# EAGLE design Backpack_Panel (EAGLE 7.2.0)
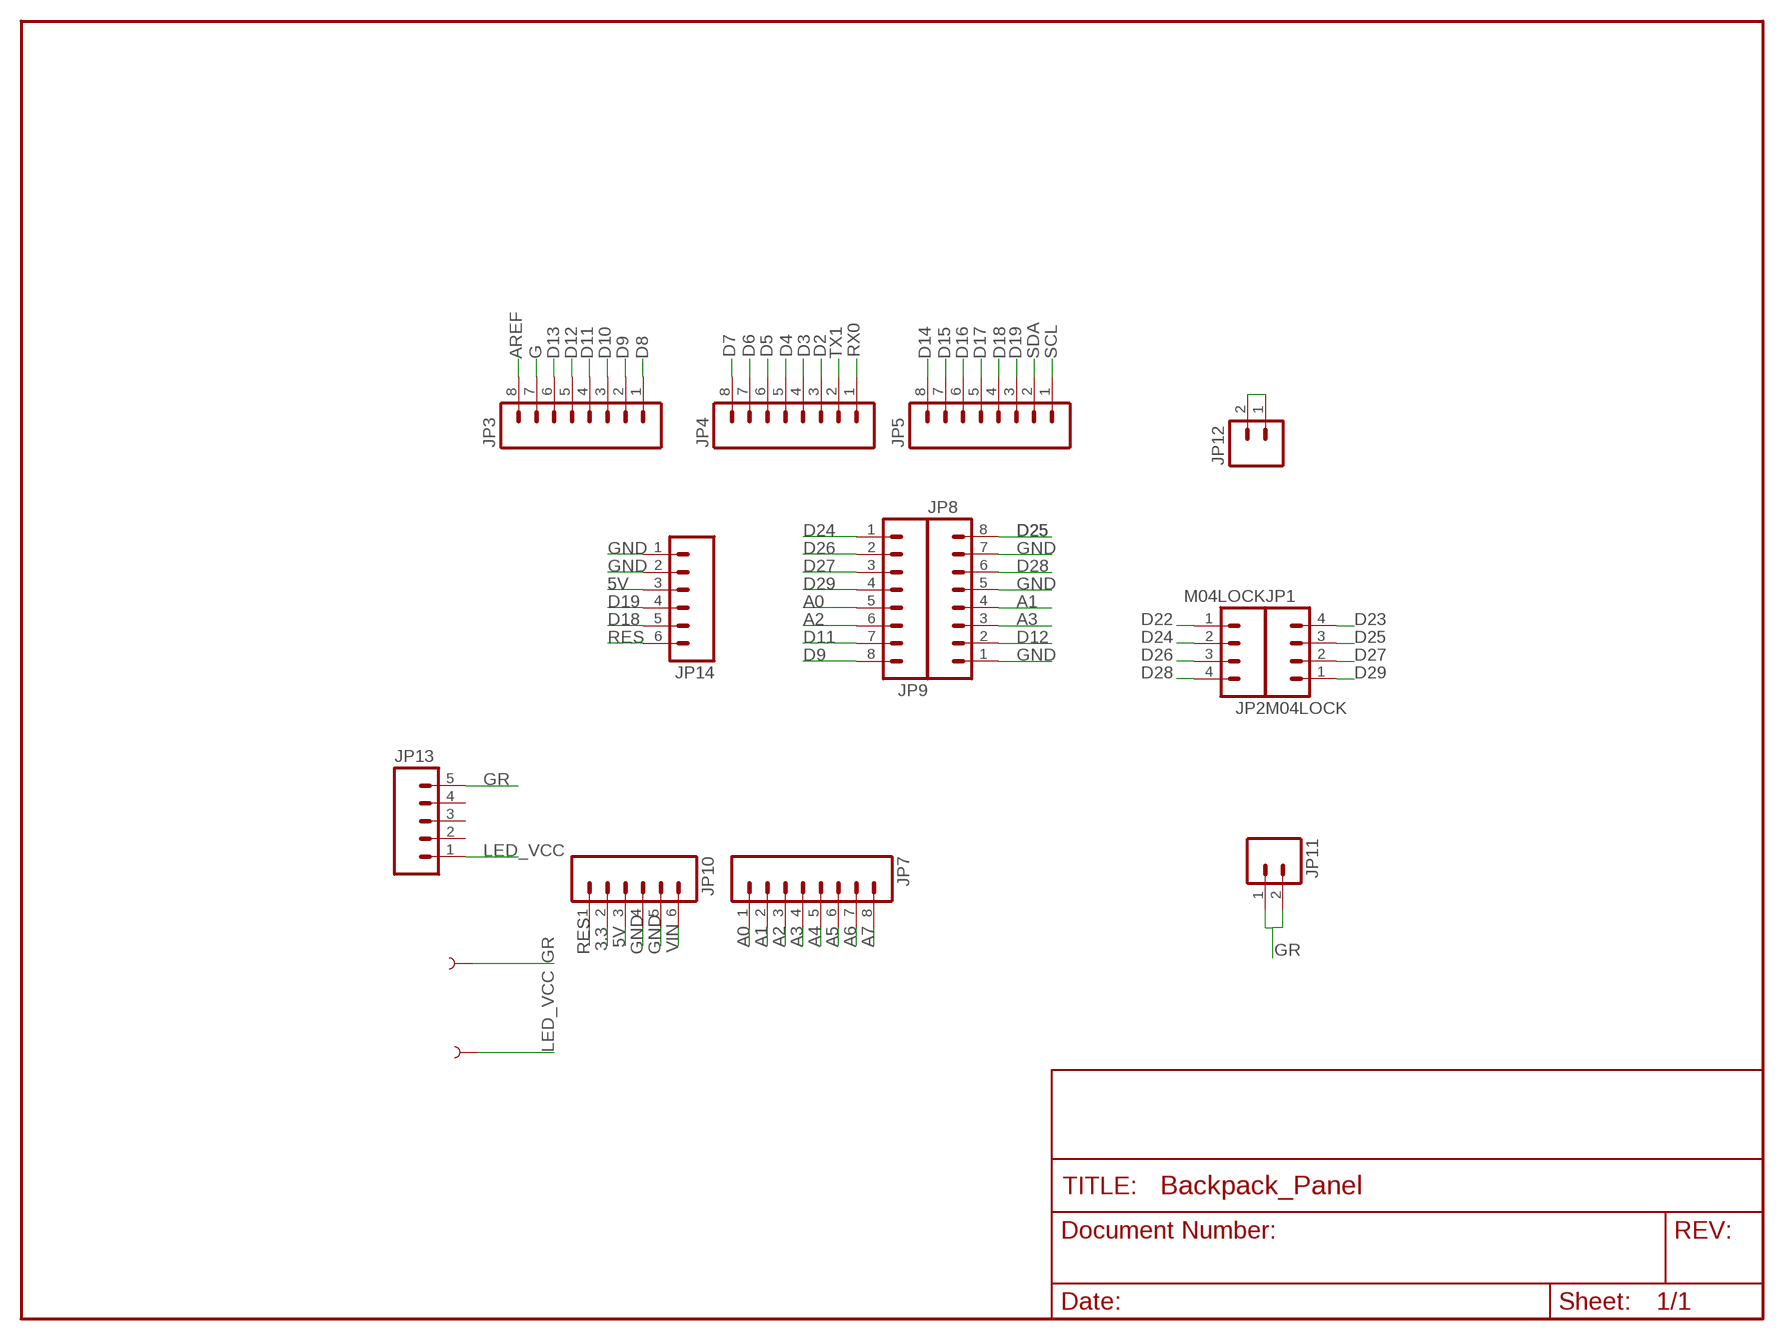
[diagram p0: schematic, sheet 1]

## Parts
JP1  M04LOCK  [1X04_LOCK]
JP2  M04LOCK  [1X04_LOCK]
JP3  M08LOCK  [1X08_LOCK]
JP4  M08LOCK  [1X08_LOCK]
JP5  M08LOCK  [1X08_LOCK]
JP7  M08LOCK  [1X08_LOCK]
JP8  M08LOCK  [1X08_LOCK]
JP9  M08LOCK  [1X08_LOCK]
JP10  M06LOCK  [1X06_LOCK]
JP11  M02LOCK  [1X02_LOCK]
JP12  M02LOCK  [1X02_LOCK]
JP13  M05LOCK  [1X05_LOCK]
JP14  M06LOCK  [1X06_LOCK]
U$1  SEWTAP2  [PETAL-LONG-2]
U$2  SEWTAP2  [PETAL-LONG-2]

## Nets
3.3: JP10.2
5V: JP10.3 JP14.3
A0: JP7.1 JP9.5
A1: JP7.2 JP8.4
A2: JP7.3 JP9.6
A3: JP7.4 JP8.3
A4: JP7.5
A5: JP7.6
A6: JP7.7
A7: JP7.8
AREF: JP3.8
D2: JP4.3
D3: JP4.4
D4: JP4.5
D5: JP4.6
D6: JP4.7
D7: JP4.8
D8: JP3.1
D9: JP3.2 JP9.8
D10: JP3.3
D11: JP3.4 JP9.7
D12: JP3.5 JP8.2
D13: JP3.6
D14: JP5.8
D15: JP5.7
D16: JP5.6
D17: JP5.5
D18: JP5.4 JP14.5
D19: JP5.3 JP14.4
D22: JP2.1
D23: JP1.4
D24: JP2.2 JP9.1
D25: JP1.3 JP8.8
D26: JP2.3 JP9.2
D27: JP1.2 JP9.3
D28: JP2.4 JP8.6
D29: JP1.1 JP9.4
G: JP3.7
GND: JP8.1 JP8.5 JP8.7 JP10.4 JP10.5 JP14.1 JP14.2
GR: JP11.1 JP11.2 JP13.5 U$1.1
LED_VCC: JP13.1 U$2.1
N$1: JP12.1 JP12.2
RES: JP10.1 JP14.6
RX0: JP4.1
SCL: JP5.1
SDA: JP5.2
TX1: JP4.2
VIN: JP10.6
Unconnected: JP13.2 JP13.3 JP13.4

## Library data of the parts
JP1 JP2 = SparkFun-Connectors:M04: Header 4 Standard 4-pin 0.1" header. Use with straight break away headers (SKU : PRT-00116), right angle break away headers (PRT-00553), swiss pins (PRT-00743), machine pins (PRT-00117), and female headers (PRT-00115). Molex polarized connector foot print use with SKU : PRT-08231 with associated crimp pins and housings. 1MM SMD Version SKU: PRT-10208
JP3-JP5 JP7 = SparkFun:M08: Header 8 Standard 8-pin 0.1" header. Use with straight break away headers (SKU : PRT-00116), right angle break away headers (PRT-00553), swiss pins (PRT-00743), machine pins (PRT-00117), and female headers (PRT-00115).
JP8 JP9 = SparkFun-Connectors:M08: Header 8 Standard 8-pin 0.1" header. Use with straight break away headers (SKU : PRT-00116), right angle break away headers (PRT-00553), swiss pins (PRT-00743), machine pins (PRT-00117), and female headers (PRT-00115).
JP10 = SparkFun:M06: Header 6 Standard 6-pin 0.1" header. Use with straight break away headers (SKU : PRT-00116), right angle break away headers (PRT-00553), swiss pins (PRT-00743), machine pins (PRT-00117), and female headers (PRT-00115). Molex polarized connector foot print use with SKU : PRT-08094 with associated ...
JP11 JP12 = SparkFun:M02: Header 2 Standard 2-pin 0.1" header. Use with straight break away headers (SKU : PRT-00116), right angle break away headers (PRT-00553), swiss pins (PRT-00743), machine pins (PRT-00117), and female headers (PRT-00115). Molex polarized connector foot print use with SKU : PRT-08233 with associated crimp pins and housings.
JP13 = SparkFun-Connectors:M05: Header 5 Standard 5-pin 0.1" header. Use with straight break away headers (SKU : PRT-00116), right angle break away headers (PRT-00553), swiss pins (PRT-00743), machine pins (PRT-00117), and female headers (PRT-00115). Molex polarized connector foot print use with SKU : PRT-08230 with associated crimp pins and housings.
JP14 = SparkFun-Connectors:M06: Header 6 Standard 6-pin 0.1" header. Use with straight break away headers (SKU : PRT-00116), right angle break away headers (PRT-00553), swiss pins (PRT-00743), machine pins (PRT-00117), and female headers (PRT-00115). Molex polarized connector foot print use with SKU : PRT-08094 with associated ...
U$1 U$2 = LilyPad-Wearables:SEWTAP

## Board
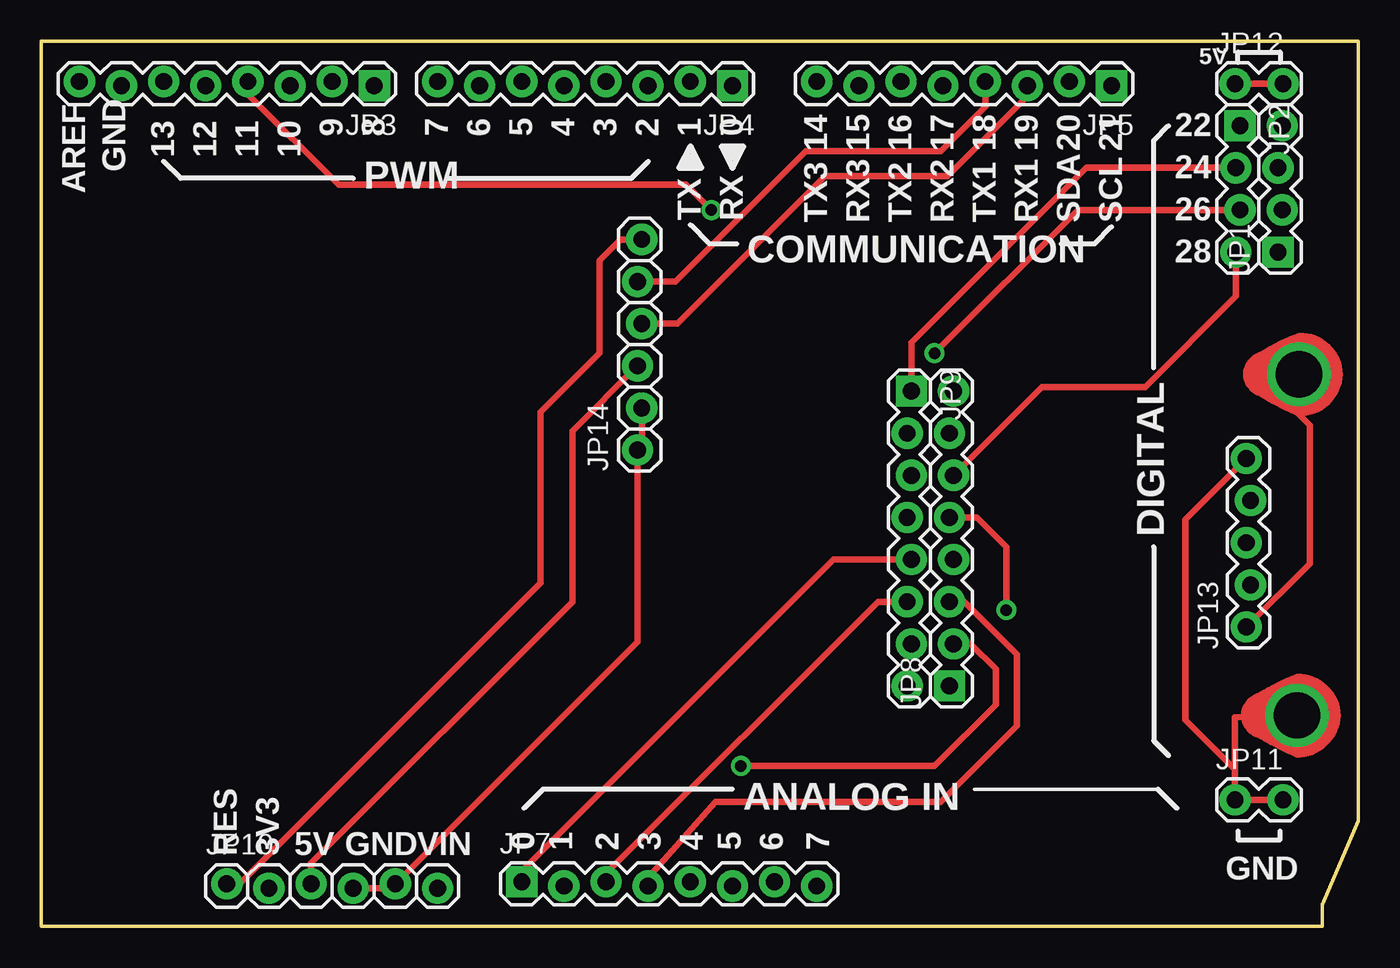
[diagram p1: board, top side]
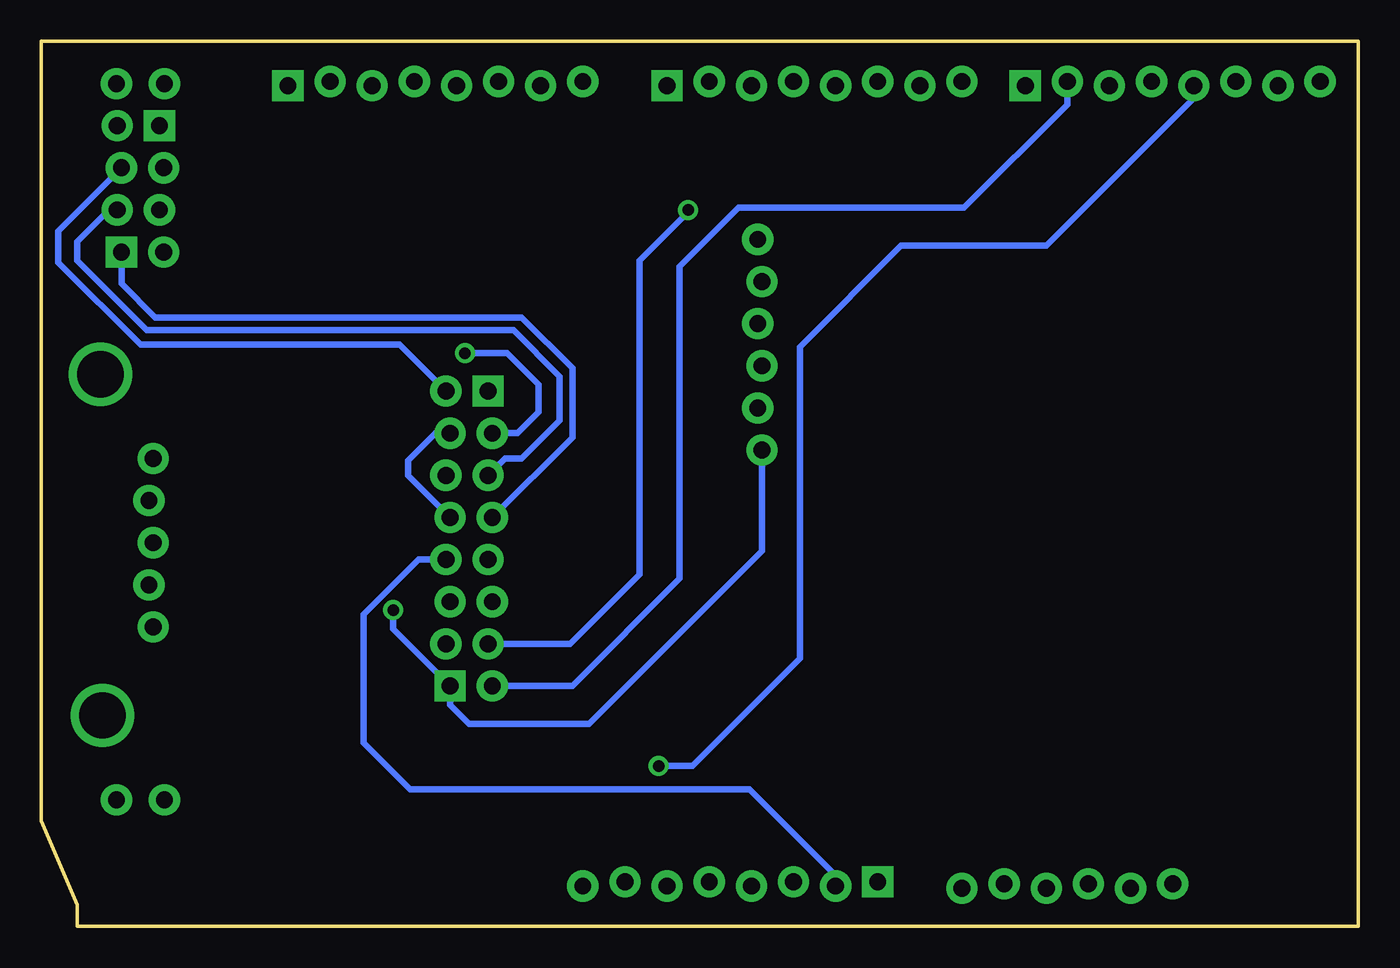
[diagram p2: board, bottom side, seen from below]

Size 79.38 x 53.34 mm. Coordinates in mm from the lower left corner, seen from the top.
Outline: 0,0 77.22,0 77.22,1.27 79.38,6.35 79.38,53.34 0,53.34 0,0
Copper layers (1*16): Top 0.035mm / dielectric 1.5mm / Bottom 0.035mm
Design rules "SparkFun": minimum track width 8mil, minimum drill 20mil, track to track 8mil, track to pad 8mil, pad to pad 8mil, via to via 8mil, smd to smd 8mil, copper to edge 10mil, drill to drill 8mil, minimum pad ring 12mil, minimum via ring 10mil, stop-mask expansion 4mil, vias tented up to drill 25mil, thermal gap 10mil

### Footprints (pad centres in the part's own frame; a part is rotated, then mirrored left to right if it is on the bottom)
1X04_LOCK = drill 1.016 pad 1.88 square: 1 0,0.127 | drill 1.016 pad 1.88: 2 2.54,-0.127; 3 5.08,0.127; 4 7.62,-0.127
1X08_LOCK = drill 1.016 pad 1.88 square: 1 0,0.127 | drill 1.016 pad 1.88: 2 2.54,-0.127; 3 5.08,0.127; 4 7.62,-0.127; 5 10.16,0.127; 6 12.7,-0.127; 7 15.24,0.127; 8 17.78,-0.127
1X06_LOCK = drill 1.016 pad 1.88: 1 0,0; 2 2.54,-0.254; 3 5.08,0; 4 7.62,-0.254; 5 10.16,0; 6 12.7,-0.254
1X02_LOCK = drill 1.016 pad 1.88: 1 -0.178,0; 2 2.718,0
1X05_LOCK = drill 1.016 pad 1.88: 1 0,0.127; 2 2.54,-0.127; 3 5.08,0.127; 4 7.62,-0.127; 5 10.16,0.127
PETAL-LONG-2 = drill 2.794: 1 0,0

### Placement (x,y rotation side)
JP1  74.68,40.64 90 top
JP2  72.14,48.26 270 top
JP3  20.07,50.8 180 top
JP4  41.66,50.8 180 top
JP5  64.52,50.8 180 top
JP7  28.96,2.54 0 top
JP8  54.86,14.48 90 top
JP9  52.32,32.26 270 top
JP10  11.18,2.54 0 top
JP11  72.14,7.62 0 top
JP12  72.14,50.8 0 top
JP13  72.77,18.03 90 top
JP14  35.94,28.7 90 top
U$1  75.69,12.7 90 top
U$2  75.82,33.27 90 top

### Tracks (layer width: path | path; a pad name or v marks a point on that pad's centre or on a via)
5V
  Top 0.406: JP10.3 16.26,3.81 32,19.56 32,29.84 JP14.3
A0
  Top 0.203: JP7.1 28.96,2.54
  Top 0.406: JP7.1 28.96,3.3 47.75,22.1 JP9.5
A1
  Bottom 0.406: JP7.2 31.5,3.05 36.7,8.26 57.15,8.26 59.94,11.05 59.94,18.8 56.64,22.1 JP8.4
A2
  Top 0.203: JP7.3 34.04,2.54
  Top 0.406: JP7.3 34.04,3.17 50.42,19.56 JP9.6
A3
  Top 0.406: JP7.4 36.58,2.92 40.64,7.49 54.23,7.49 58.8,12.07 58.8,16.38 55.5,19.68 54.86,19.68 JP8.3
D9
  Bottom 0.406: JP3.2 17.53,49.53 23.75,43.31 37.34,43.31 40.89,39.75 40.89,20.95 47.37,14.48 JP9.8
D11  (via drill 0.7)
  Top 0.406: JP3.4 12.45,50.16 17.91,44.7 38.86,44.7 v40.39,43.18
  Bottom 0.406: v40.39,43.18 40.39,43.05 43.31,40.13 43.31,21.21 47.5,17.02 JP9.7
D12  (via drill 0.7)
  Top 0.406: JP8.2 56.01,17.02 57.53,15.49 57.53,13.34 53.85,9.65 v42.16,9.65
  Bottom 0.406: JP3.5 9.91,49.91 18.8,41.02 27.56,41.02 33.66,34.93 33.66,16.13 40.13,9.65 v42.16,9.65
D18
  Top 0.406: JP5.4 56.9,49.4 54.23,46.74 46.1,46.74 38.23,38.86 JP14.5
D19
  Top 0.406: JP5.3 59.44,50.04 54.61,45.21 47.24,45.21 38.35,36.32 JP14.4
D24
  Top 0.406: JP2.2 62.99,45.72 52.45,35.18 JP9.1
D25
  Bottom 0.406: JP1.3 78.36,41.91 78.36,40.01 73.41,35.05 57.78,35.05 JP8.8
D26  (via drill 0.7)
  Top 0.406: JP2.3 62.48,43.18 v53.85,34.54
  Bottom 0.406: v53.85,34.54 51.31,34.54 49.4,32.64 49.4,30.99 50.67,29.72 JP9.2
D27
  Bottom 0.406: JP1.2 75.31,43.18 77.22,41.28 77.22,40.13 73.03,35.94 50.93,35.94 48.13,33.15 48.13,30.48 50.42,28.19 51.44,28.19 JP9.3
D28
  Top 0.406: JP2.4 72.01,37.97 66.55,32.51 60.33,32.51 JP8.6
D29
  Bottom 0.406: JP1.1 74.55,38.73 72.52,36.7 50.42,36.7 47.37,33.66 47.37,29.46 JP9.4
GND  (via drill 0.7)
  Top 0.406: JP10.4 21.08,2.29 JP10.5 35.94,17.14 JP14.1 35.94,28.19 36.2,28.45 JP14.2 | JP8.5 56.39,24.64 58.17,22.86 v58.17,19.05
  Bottom 0.406: JP14.1 35.94,22.61 46.35,12.19 53.59,12.19 54.74,13.34 JP8.1 58.17,17.91 v58.17,19.05 | JP8.7 55.63,29.72 57.28,28.07 57.28,27.18 JP8.5
GR
  Top 0.406: JP11.2 JP11.1 71.96,9.45 | 71.96,9.45 68.96,12.45 68.96,24.51 JP13.5 | U$1.1 71.96,12.57 71.96,9.45
LED_VCC
  Top 0.406: U$2.1 73.66,33.02 76.45,30.23 76.45,21.84 JP13.1
N$1
  Top 0.406: JP12.2 JP12.1
RES
  Top 0.406: JP10.1 11.94,2.54 30.1,20.7 30.1,30.99 33.66,34.54 33.66,40.13 34.92,41.4 JP14.6

### Text on the board
tPlace: 5V | 9 | 8 | 7 | 6 | 5 | 4 | 3 | 2 | 1 | 0 | 14 | 15 | 16 | 17 | 18 | 19 | 20 | 21 | 22 | 13 | 12 | 11 | 10 | GND | 24 | AREF | PWM | TX | RX | TX3 | RX3 | TX2 | RX2 | TX1 | RX1 | SDA | SCL | 26 | COMMUNICATION | 28 | DIGITAL | ANALOG IN | RES | 3V3 | 5V | GND | VIN | 0 | 1 | 2 | 3 | 4 | 5 | 6 | 7 | GND